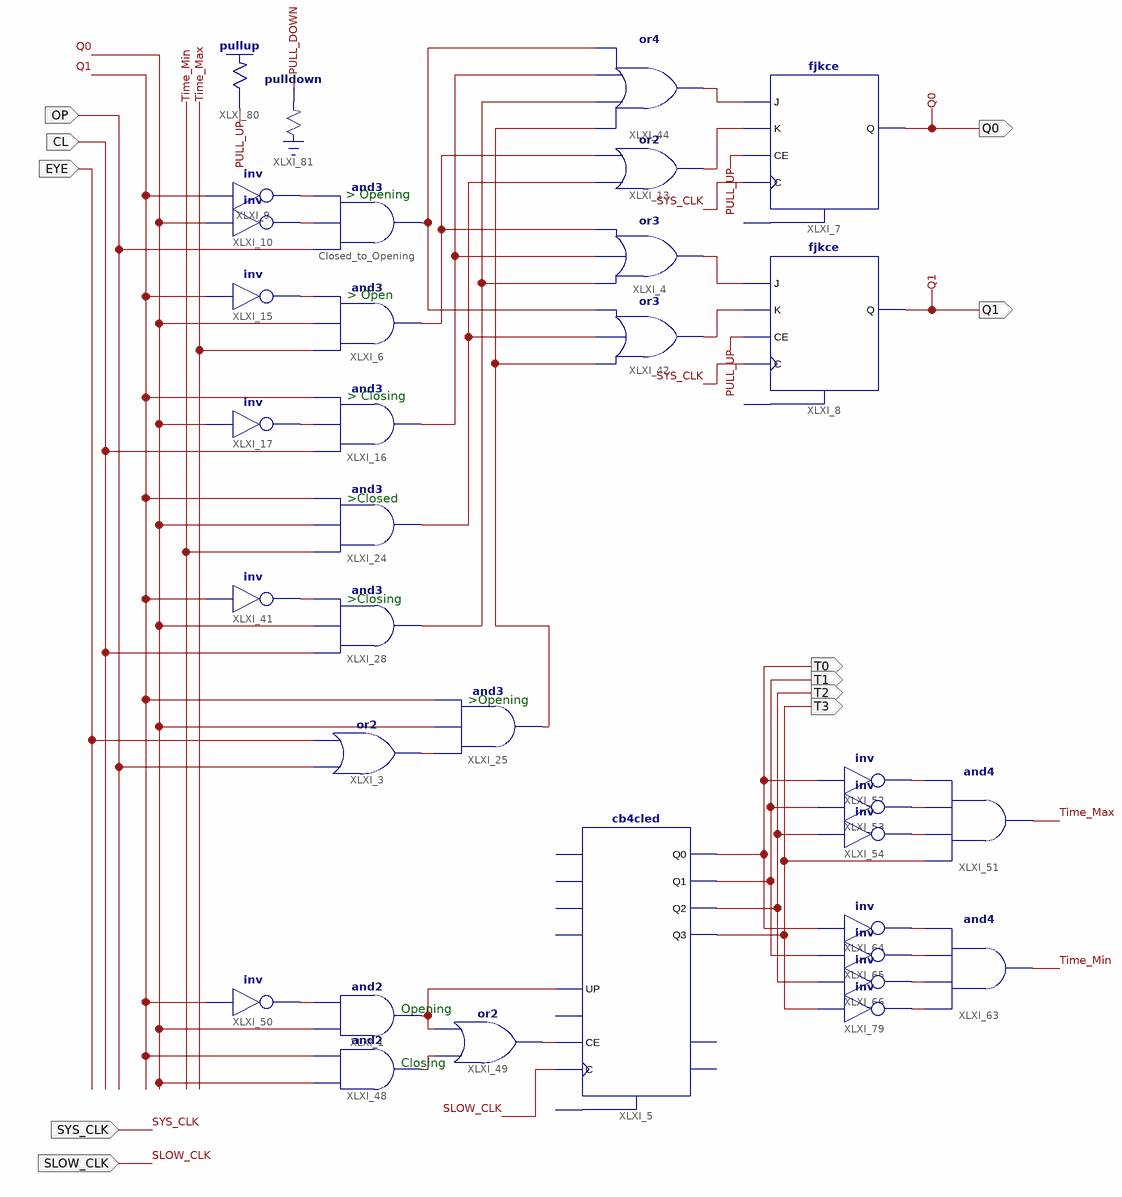
[diagram p0: schematic sheet 1]
// Xilinx ISE schematic experiment2.sch (spartan3e) as structural Verilog: 34 symbols, 11 ports
module experiment2 (
  input  OP,
  input  CL,
  input  EYE,
  input  SYS_CLK,
  input  SLOW_CLK,
  output Q1,
  output Q0,
  output T0,
  output T1,
  output T2,
  output T3
);

  wire PULL_DOWN, PULL_UP, Time_Max, Time_Min, XLXN_7, XLXN_8, XLXN_9, XLXN_10, XLXN_11, XLXN_15, XLXN_16,
       XLXN_17, XLXN_25, XLXN_27, XLXN_42, XLXN_43, XLXN_45, XLXN_55, XLXN_69, XLXN_70, XLXN_73, XLXN_74,
       XLXN_75, XLXN_85, XLXN_86, XLXN_87, XLXN_96, XLXN_97, XLXN_98, XLXN_118, XLXN_152;

  and XLXI_1 (XLXN_74, Q0, XLXN_152);
  and Closed_to_Opening (XLXN_11, OP, XLXN_16, XLXN_15);
  or XLXI_4 (XLXN_9, XLXN_69, XLXN_42, XLXN_25);
  cb4cled XLXI_5 (
    .C(SLOW_CLK), .CE(XLXN_75), .UP(XLXN_74), .Q0(T0), .Q1(T1), .Q2(T2), .Q3(T3));  // open: CLR, D0, D1, D2, D3, L, CEO, TC
  and XLXI_6 (XLXN_25, Time_Max, Q0, XLXN_17);
  not XLXI_9 (XLXN_15, Q1);
  not XLXI_10 (XLXN_16, Q0);
  not XLXI_15 (XLXN_17, Q1);
  and XLXI_16 (XLXN_42, CL, XLXN_27, Q1);
  not XLXI_17 (XLXN_27, Q0);
  fjkce XLXI_8 (.C(SYS_CLK), .CE(PULL_UP), .J(XLXN_9), .K(XLXN_10), .Q(Q1));  // open: CLR
  fjkce XLXI_7 (.C(SYS_CLK), .CE(PULL_UP), .J(XLXN_7), .K(XLXN_8), .Q(Q0));  // open: CLR
  and XLXI_24 (XLXN_43, Time_Min, Q0, Q1);
  and XLXI_28 (XLXN_69, CL, Q0, XLXN_55);
  and XLXI_25 (XLXN_70, XLXN_45, Q0, Q1);
  not XLXI_41 (XLXN_55, Q1);
  or XLXI_42 (XLXN_10, XLXN_70, XLXN_43, XLXN_11);
  or XLXI_44 (XLXN_7, XLXN_70, XLXN_69, XLXN_42, XLXN_11);
  or XLXI_13 (XLXN_8, XLXN_43, XLXN_25);
  and XLXI_48 (XLXN_73, Q0, Q1);
  or XLXI_3 (XLXN_45, OP, EYE);
  or XLXI_49 (XLXN_75, XLXN_73, XLXN_74);
  not XLXI_52 (XLXN_85, T0);
  not XLXI_53 (XLXN_86, T1);
  not XLXI_54 (XLXN_87, T2);
  and XLXI_51 (Time_Max, T3, XLXN_87, XLXN_86, XLXN_85);
  and XLXI_63 (Time_Min, XLXN_118, XLXN_98, XLXN_97, XLXN_96);
  not XLXI_64 (XLXN_96, T0);
  not XLXI_65 (XLXN_97, T1);
  not XLXI_66 (XLXN_98, T2);
  not XLXI_79 (XLXN_118, T3);
  \pullup  XLXI_80 (.O(PULL_UP));
  \pulldown  XLXI_81 (.O(PULL_DOWN));
  not XLXI_50 (XLXN_152, Q1);

  // Notes on the sheet:
  //   > Opening
  //   > Open
  //   > Closing
  //   >Closed
  //   >Closing
  //   >Opening
  //   Opening
  //   Closing
endmodule
